# EAGLE design PCB (EAGLE 9.6.2)
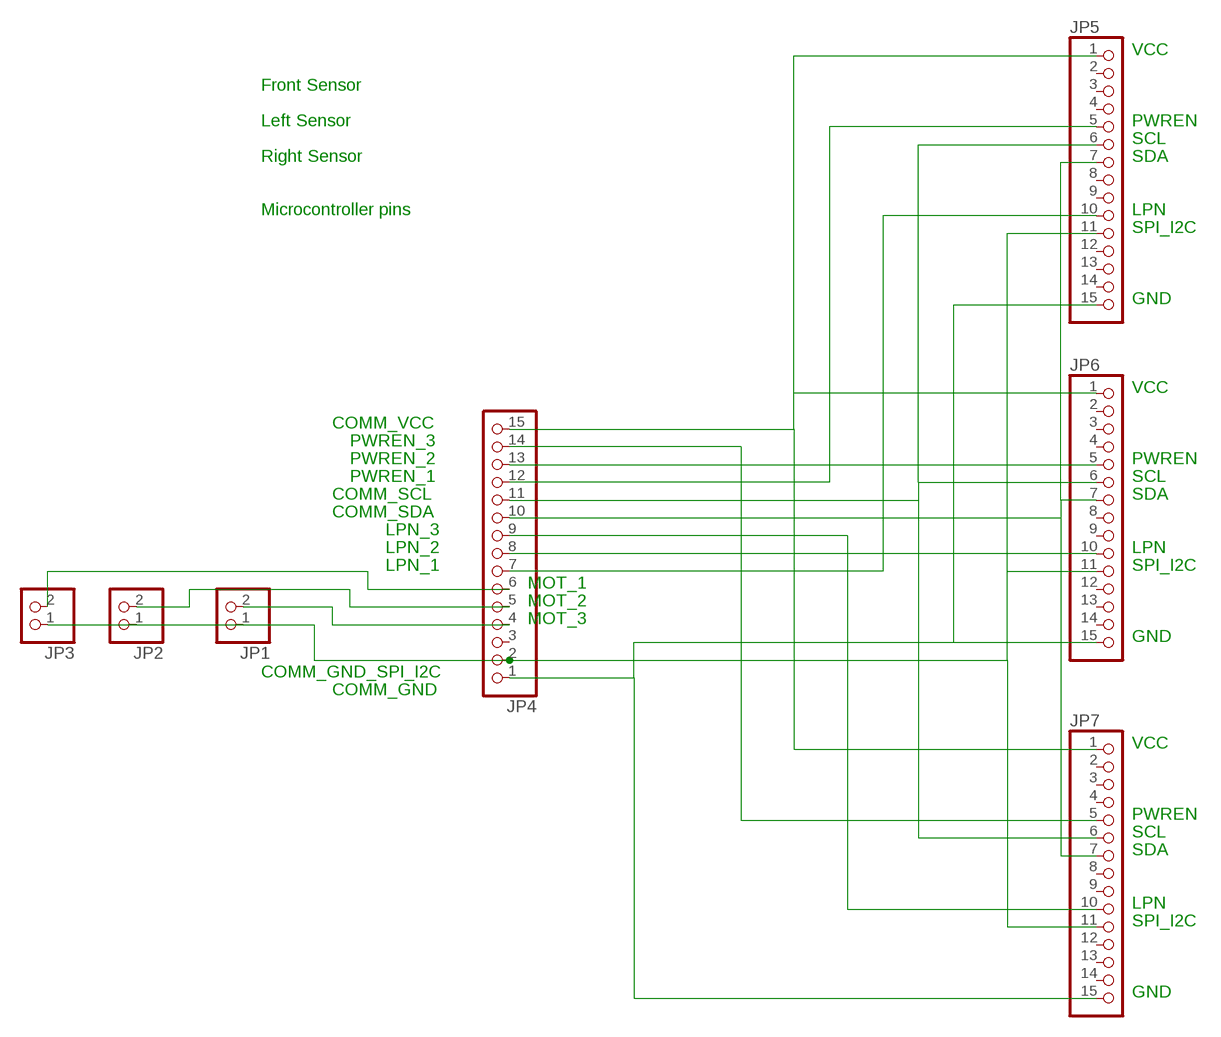
[diagram p0: schematic, sheet 1]

## Parts
JP1  PINHD-1X2  [1X02]
JP2  PINHD-1X2  [1X02]
JP3  PINHD-1X2  [1X02]
JP4  PINHD-1X15  [1X15]
JP5  PINHD-1X15  [1X15]
JP6  PINHD-1X15  [1X15]
JP7  PINHD-1X15  [1X15]

## Nets
N$1: JP4.15 JP5.1 JP6.1 JP7.1
N$2: JP4.1 JP5.15 JP6.15 JP7.15
N$3: JP4.7 JP4.10 JP5.7 JP6.7 JP7.7
N$4: JP4.11 JP5.6 JP6.6 JP7.6
N$5: JP4.12 JP5.5
N$6: JP4.13 JP6.5
N$7: JP4.14 JP7.5
N$8: JP5.10
N$9: JP4.8 JP6.10
N$10: JP4.9 JP7.10
N$11: JP1.1 JP4.2 JP5.11 JP6.11 JP7.11
N$12: JP2.1 JP3.1
N$13: JP3.2 JP4.6
N$14: JP2.2 JP4.5
N$15: JP1.2 JP4.4
Unconnected: JP4.3 JP5.2 JP5.3 JP5.4 JP5.8 JP5.9 JP5.12 JP5.13 JP5.14 JP6.2 JP6.3 JP6.4 JP6.8 JP6.9 JP6.12 JP6.13 JP6.14 JP7.2 JP7.3 JP7.4 JP7.8 JP7.9 JP7.12 JP7.13 JP7.14

## Notes on the sheet
- VCC
- Front Sensor
- Left Sensor | PWREN
- SCL
- Right Sensor | SDA
- Microcontroller pins | LPN
- SPI_I2C
- GND
- VCC
- COMM_VCC
- PWREN_3
- PWREN_2 | PWREN
- PWREN_1 | SCL
- COMM_SCL | SDA
- COMM_SDA
- LPN_3
- LPN_2 | LPN
- LPN_1 | SPI_I2C
- MOT_1
- MOT_2
- MOT_3
- GND
- COMM_GND_SPI_I2C
- COMM_GND
- VCC
- PWREN
- SCL
- SDA
- LPN
- SPI_I2C
- GND

## Library data of the parts
JP1-JP3 = pinhead:PINHD-1X2: PIN HEADER
JP4-JP7 = pinhead:PINHD-1X15: PIN HEADER

## Board
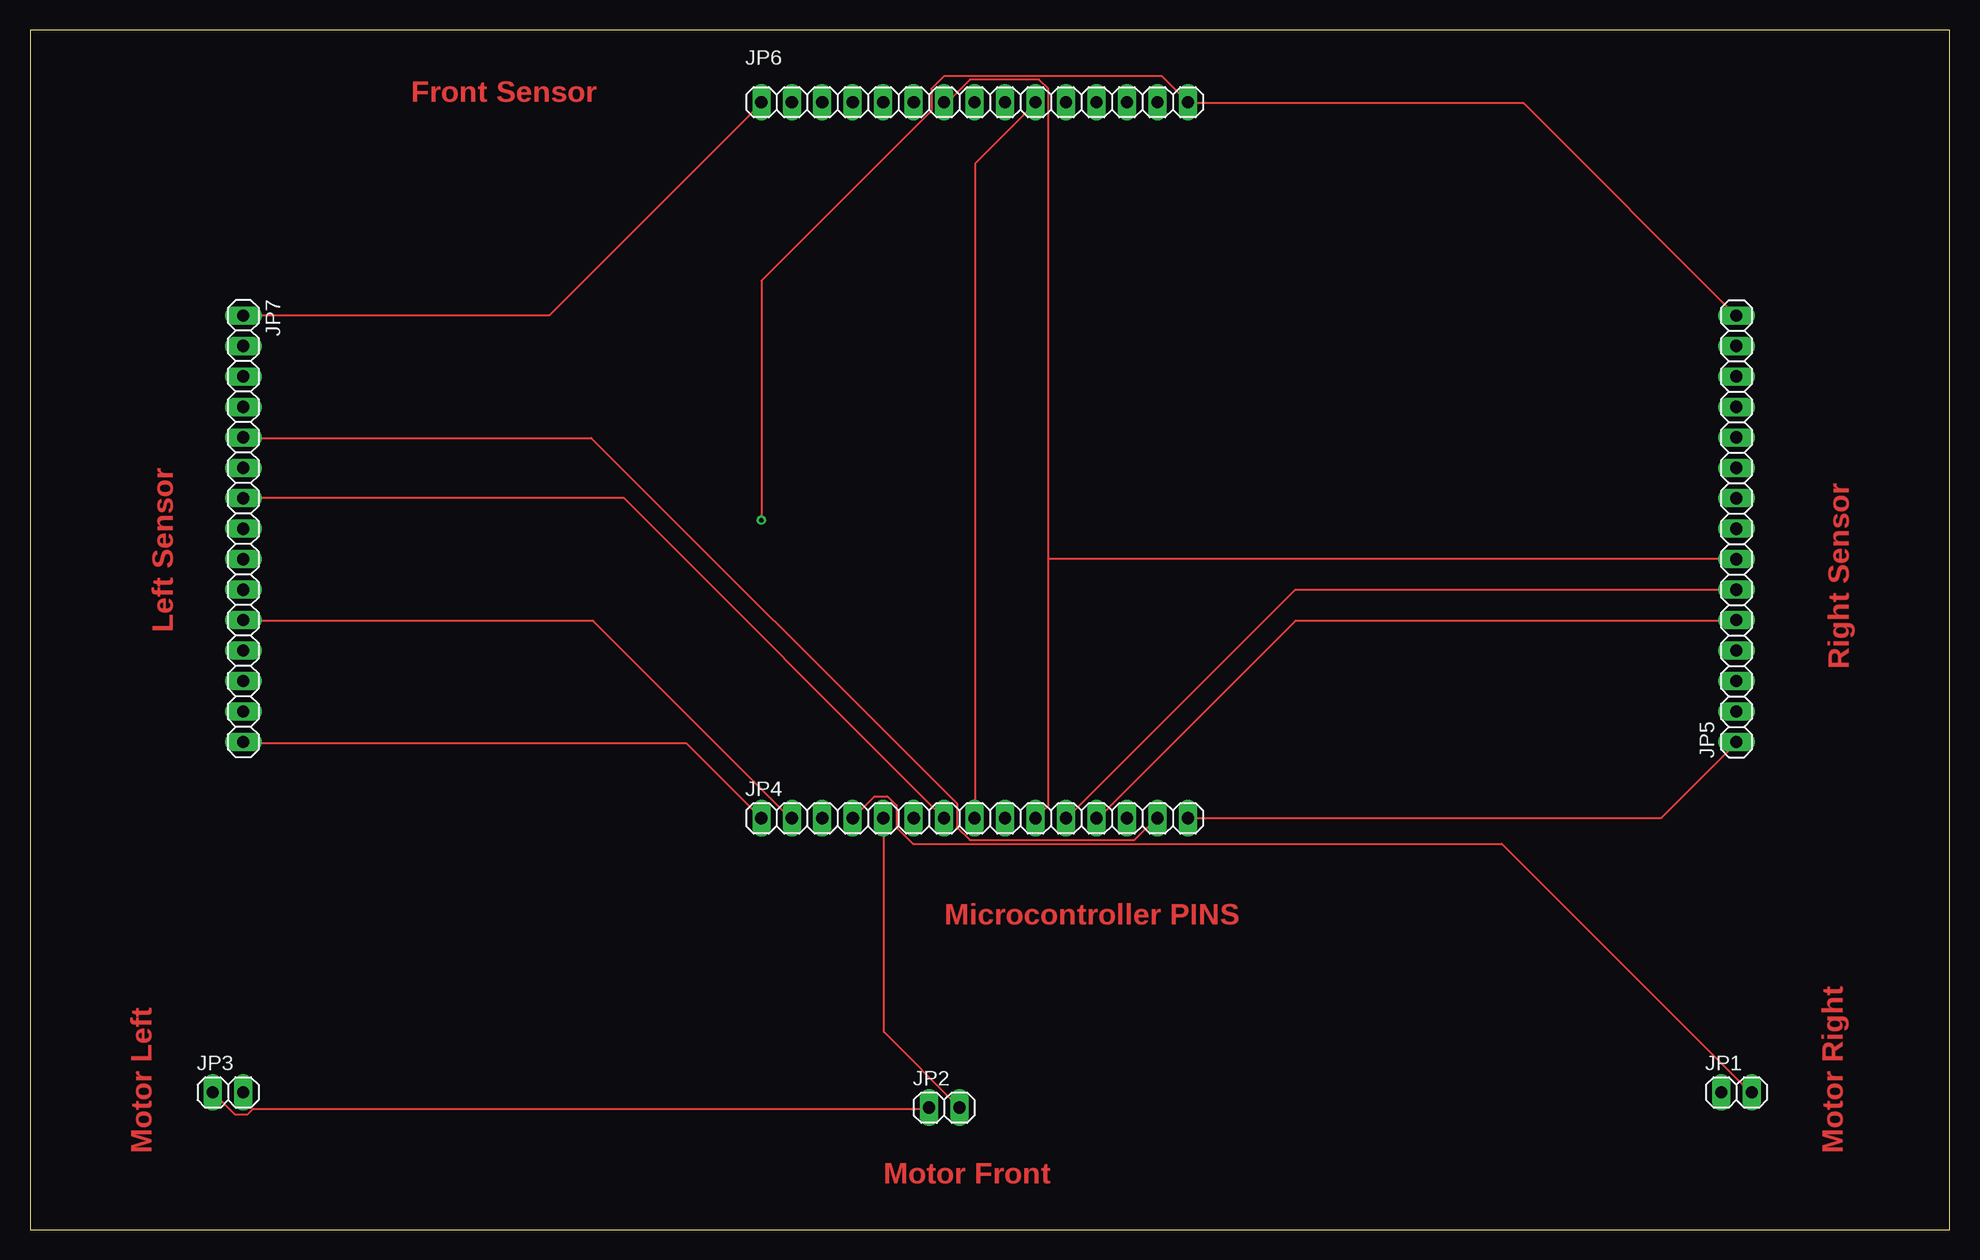
[diagram p1: board, top side]
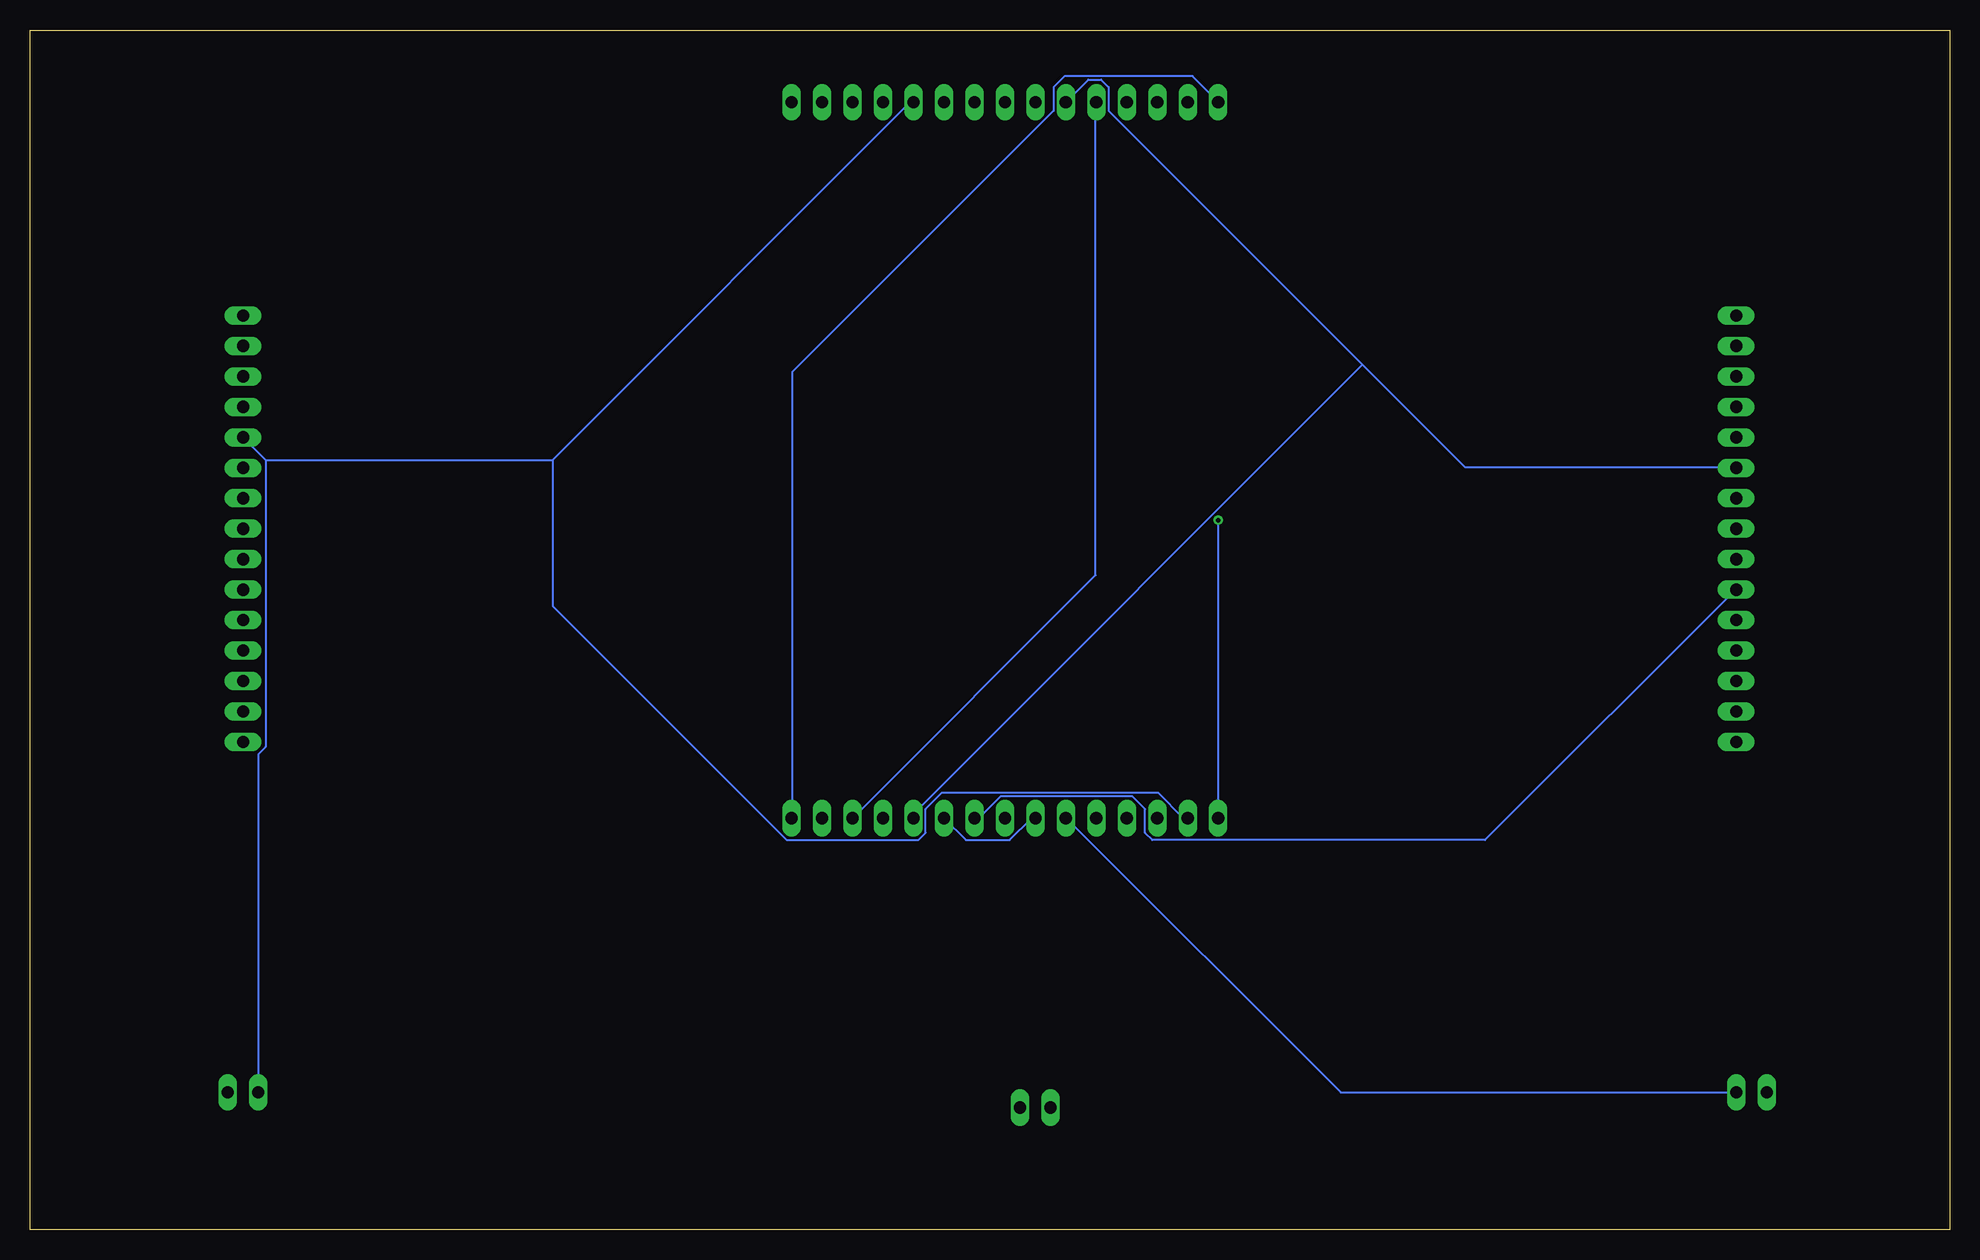
[diagram p2: board, bottom side, seen from below]

Size 160 x 100 mm. Coordinates in mm from the lower left corner, seen from the top.
Outline: 0,0 160,0 160,100 0,100 0,0
Copper layers (1*16): Top 0.035mm / dielectric 1.5mm / Bottom 0.035mm
Design rules "default": minimum track width 6mil, minimum drill 0.35mm, track to track 6mil, track to pad 6mil, pad to pad 6mil, via to via 6mil, smd to smd 6mil, copper to edge 40mil, drill to drill 6mil, minimum pad ring 10mil, minimum via ring 8mil, stop-mask expansion 4mil, vias tented up to drill 0mil, thermal gap 10mil

### Footprints (pad centres in the part's own frame; a part is rotated, then mirrored left to right if it is on the bottom)
1X02 = drill 1.016 long: 1 -1.27,0; 2 1.27,0
1X15 = drill 1.016 long: 1 -17.78,0; 2 -15.24,0; 3 -12.7,0; 4 -10.16,0; 5 -7.62,0; 6 -5.08,0; 7 -2.54,0; 8 0,0; 9 2.54,0; 10 5.08,0; 11 7.62,0; 12 10.16,0; 13 12.7,0; 14 15.24,0; 15 17.78,0

### Placement (x,y rotation side)
JP1  142.24,11.43 0 top
JP2  76.2,10.16 0 top
JP3  16.51,11.43 0 top
JP4  78.74,34.29 0 top
JP5  142.24,58.42 90 top
JP6  78.74,93.98 0 top
JP7  17.78,58.42 270 top

### Tracks (layer width: path | path; a pad name or v marks a point on that pad's centre or on a via)
N$1
  Top 0.152: JP4.15 135.94,34.29 142.19,40.54 JP5.1 | JP7.1 43.28,76.2 60.96,93.88 JP6.1
  Bottom 0.152: JP4.15 96.47,34.29 96.47,71.48 74.68,93.27 74.68,95.25 73.76,96.16 63.09,96.16 60.96,94.03 JP6.1
N$2  (via drill 0.35)
  Top 0.152: JP4.1 54.71,40.54 17.83,40.54 JP7.15 | JP5.15 142.19,76.2 124.51,93.88 96.62,93.88 JP6.15 94.34,96.16 76.2,96.16 75.13,95.1 75.13,93.27 60.96,79.1 v60.96,59.13
  Bottom 0.152: v60.96,59.13 JP4.1
N$3
  Top 0.152: JP7.7 49.53,60.96 JP4.7 | 84.89,55.93 84.89,35.36 JP4.10 | 84.89,55.93 84.89,95.1 84.12,95.86 78.33,95.86 76.5,94.03 76.2,94.03 JP6.7 | 84.89,55.93 142.19,55.93 JP5.7
  Bottom 0.152: JP4.7 76.5,34.29 78.33,32.46 81.99,32.46 JP4.10
N$4
  Top 0.152: JP5.6 105.46,53.34 86.41,34.29 JP4.11
  Bottom 0.152: 48.92,72.08 70.1,93.27 70.1,95.25 70.71,95.86 71.78,95.86 JP6.6 | 48.92,72.08 40.39,63.55 17.83,63.55 JP7.6 | 48.92,72.08 86.26,34.75 86.26,34.29 JP4.11
N$5
  Top 0.152: JP4.12 89,34.29 105.46,50.75 142.19,50.75 JP5.5
N$6
  Bottom 0.152: JP4.13 71.17,54.56 71.17,93.88 JP6.5
N$7
  Top 0.152: JP4.14 93.88,34.29 92.05,32.46 78.33,32.46 77.27,33.53 77.27,35.51 46.79,65.99 17.83,65.99 JP7.5
N$9
  Top 0.152: JP4.8 78.79,34.29 78.79,88.85 83.82,93.88 JP6.10
N$10
  Bottom 0.152: JP4.9 80.92,34.29 79.1,36.12 68.12,36.12 67.06,35.05 67.06,33.07 66.45,32.46 38.71,32.46 17.83,53.34 JP7.10
N$11
  Top 0.152: JP7.11 17.83,50.75 46.94,50.75 63.4,34.29 JP4.2
  Bottom 0.152: JP1.1 140.97,39.62 140.36,40.23 140.36,64.16 | JP5.11 140.36,64.16 | 116.43,64.16 86.72,93.88 86.41,93.88 JP6.11 | 140.36,64.16 116.43,64.16 | JP4.2 63.86,34.29 65.99,36.42 83.97,36.42 85.34,35.05 85.34,33.07 85.95,32.46 96.93,32.46 116.43,51.97 116.43,64.16
N$12
  Top 0.152: JP3.1 17.07,9.6 18.14,9.6 18.59,10.06 74.83,10.06 JP2.1
N$13
  Bottom 0.152: JP3.2 50.75,11.43 73.61,34.29 JP4.6
N$14
  Top 0.152: JP2.2 71.17,16.46 71.17,34.29 JP4.5
N$15
  Top 0.152: JP4.4 70.41,36.12 71.48,36.12 72.24,35.36 72.24,33.53 73.61,32.16 122.68,32.16 143.41,11.43 JP1.2

### Text on the board
Top: Front Sensor | Left Sensor | Right Sensor | Microcontroller PINS | Motor Left | Motor Right | Motor Front